# EAGLE design adcmp572-pulser (EAGLE 9.4.2)
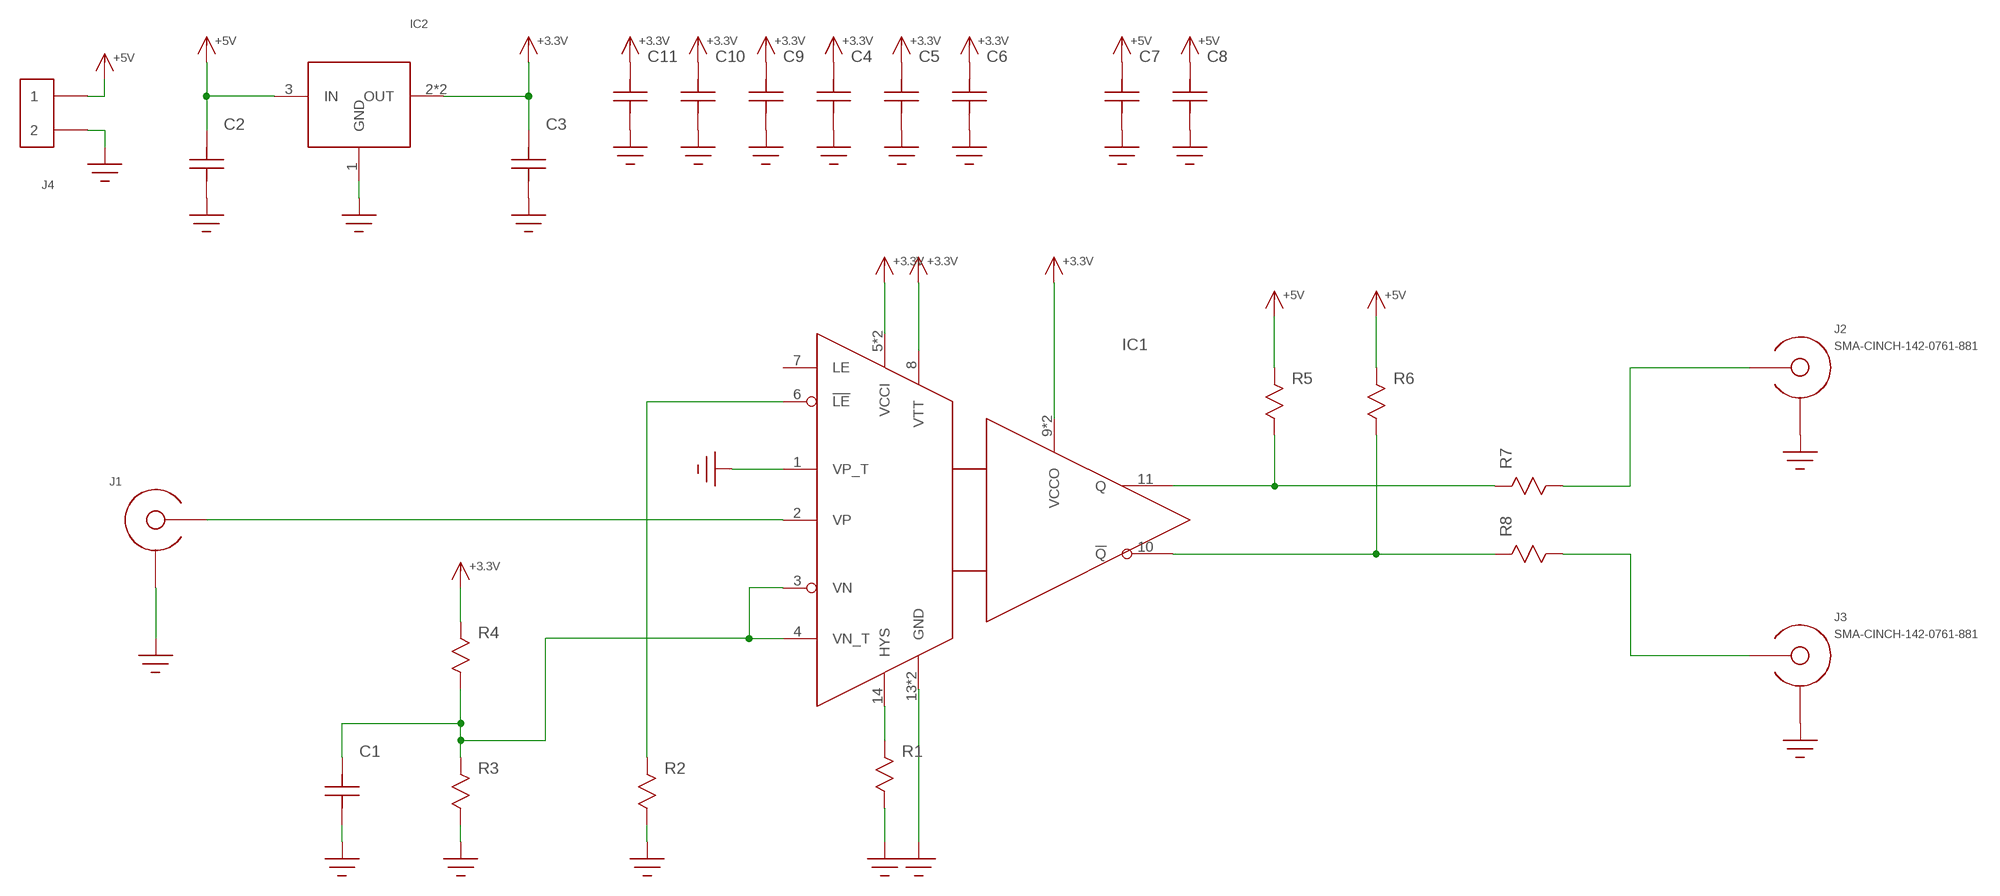
[diagram p0: schematic, sheet 1]

## Parts
C1  C0603  [C0603]
C2  C1206  [1206]
C3  C1206  [1206]
C4  C  [C0402]
C5  C  [C0402]
C6  C  [C0402]
C7  C  [C0402]
C8  C  [C0402]
C9  C  [C0402]
C10  C0201  [0201]
C11  C0201  [0201]
IC1  ADCMP572  [TQFN16-EP]
IC2  AZ1117E  [SOT-223]
J1  SMA-EDGE-LAUNCH4L-4020-TAPER-FIXED  [SMA_EDGE_LAUNCH_4L_4020_TAPER_FIXED]
J2  SMA-CINCH-142-0761-881  [SMA-CINCH-142-0761-881]
J3  SMA-CINCH-142-0761-881  [SMA-CINCH-142-0761-881]
J4  HEADER_2PIN  [HEADER_2PIN]
R1  R0603  [R0603]
R2  R0603  [R0603]
R3  R0603  [R0603]
R4  R0603  [R0603]
R5  R0402  [0402]
R6  R0402  [0402]
R7  R0402  [0402]
R8  R0402  [0402]

## Nets
+3.3V: C3.P$2 C4.2 C5.2 C6.2 C9.2 C10.P$2 C11.P$2 IC1.5(VCCI) IC1.8(VTT) IC1.9(VCCO) IC1.12(VCCO) IC1.16(VCCI) IC2.2(OUT) IC2.4(OUT) R4.P$1
+5V: C2.P$2 C7.2 C8.2 IC2.3(IN) J4.1 R5.1 R6.1
GND: C1.P$1 C2.P$1 C3.P$1 C4.1 C5.1 C6.1 C7.1 C8.1 C9.1 C10.P$1 C11.P$1 IC1.1(VP_T) IC1.13(GND) IC1.15(GND) IC2.1(GND) J1.BOTTOM_GND(SHIELD) J1.GND@1(SHIELD) J1.GND@2(SHIELD) J1.GND@3(SHIELD) J1.GND@4(SHIELD) J1.GND@5(SHIELD) J1.GND@6(SHIELD) J1.GND@7(SHIELD) J1.GND@8(SHIELD) J1.GND@14(SHIELD) J1.GND@15(SHIELD) J1.GND@16(SHIELD) J1.GND@17(SHIELD) J1.GND_PAD1(SHIELD) J1.GND_PAD2(SHIELD) J1.P$1(SHIELD) J1.P$2(SHIELD) J2.GND@1(SHIELD) J2.GND@2(SHIELD) J2.GND@3(SHIELD) J2.HOLE@1(SHIELD) J2.HOLE@2(SHIELD) J2.HOLE@3(SHIELD) J2.HOLE@4(SHIELD) J2.VIA@1(SHIELD) J2.VIA@2(SHIELD) J2.VIA@3(SHIELD) J2.VIA@4(SHIELD) J2.VIA@5(SHIELD) J2.VIA@6(SHIELD) J3.GND@1(SHIELD) J3.GND@2(SHIELD) J3.GND@3(SHIELD) J3.HOLE@1(SHIELD) J3.HOLE@2(SHIELD) J3.HOLE@3(SHIELD) J3.HOLE@4(SHIELD) J3.VIA@1(SHIELD) J3.VIA@2(SHIELD) J3.VIA@3(SHIELD) J3.VIA@4(SHIELD) J3.VIA@5(SHIELD) J3.VIA@6(SHIELD) J4.2 R1.P$2 R2.P$2 R3.P$2
N$1: IC1.14(HYS) R1.P$1
N$2: IC1.6(!LE!) R2.P$1
N$3 [12.5-6]: IC1.2(VP) J1.CENTER@1(CENTER) J1.P$3(CENTER)
N$4: C1.P$2 IC1.3(VN) IC1.4(VN_T) R3.P$1 R4.P$2
N$5 [12.5-6]: J2.CENTER R7.2
N$6 [12.5-6]: J3.CENTER R8.2
N$7: IC1.11(Q) R5.2 R7.1
N$8: IC1.10(!Q!) R6.2 R8.1
Unconnected: IC1.7(LE)

## Library data of the parts
C1-C11 = yapo:C
IC1 = yapo:ADCMP572
IC2 = yapo:AZ1117E
J1 = yapo:SMA-EDGE-LAUNCH
J2 J3 = yapo:SMA-CINCH-142-0761-881
J4 = yapo:HEADER_2PIN
R1-R8 = yapo:R

## Net classes
1 12.5-6: width 0.318 mm, clearance 0.152 mm

## Board
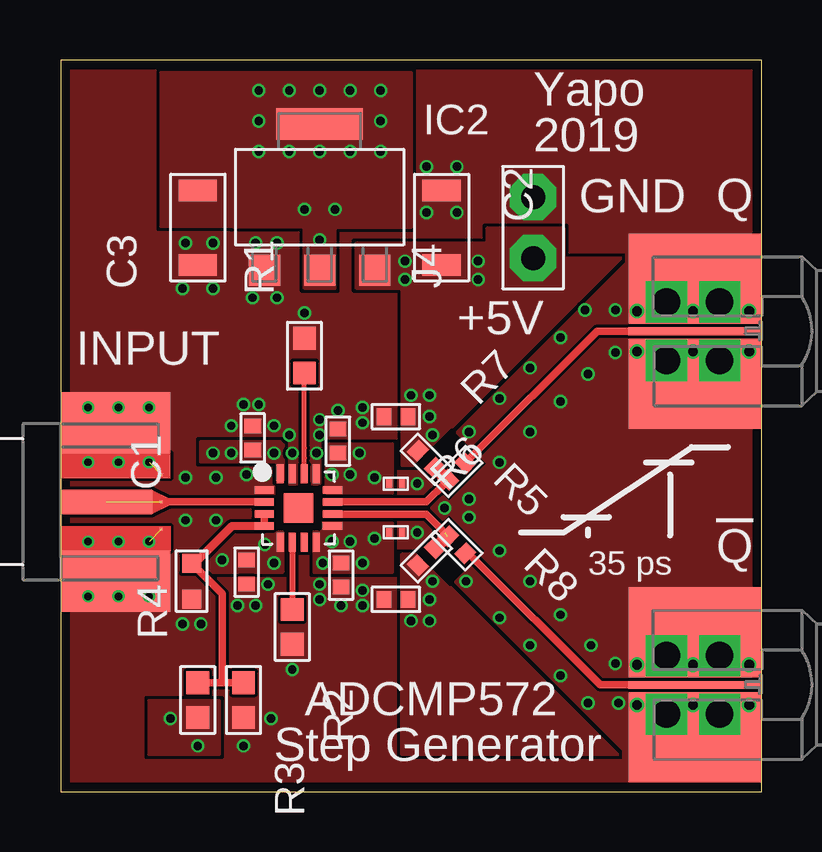
[diagram p1: board, top side]
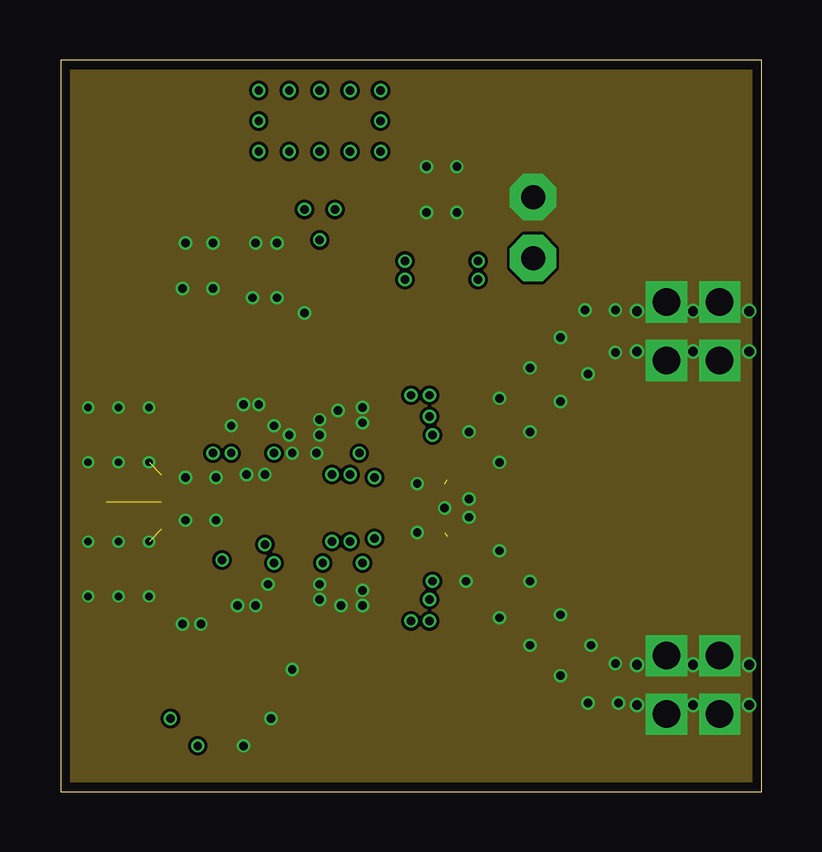
[diagram p2: board, inner layer Route2]
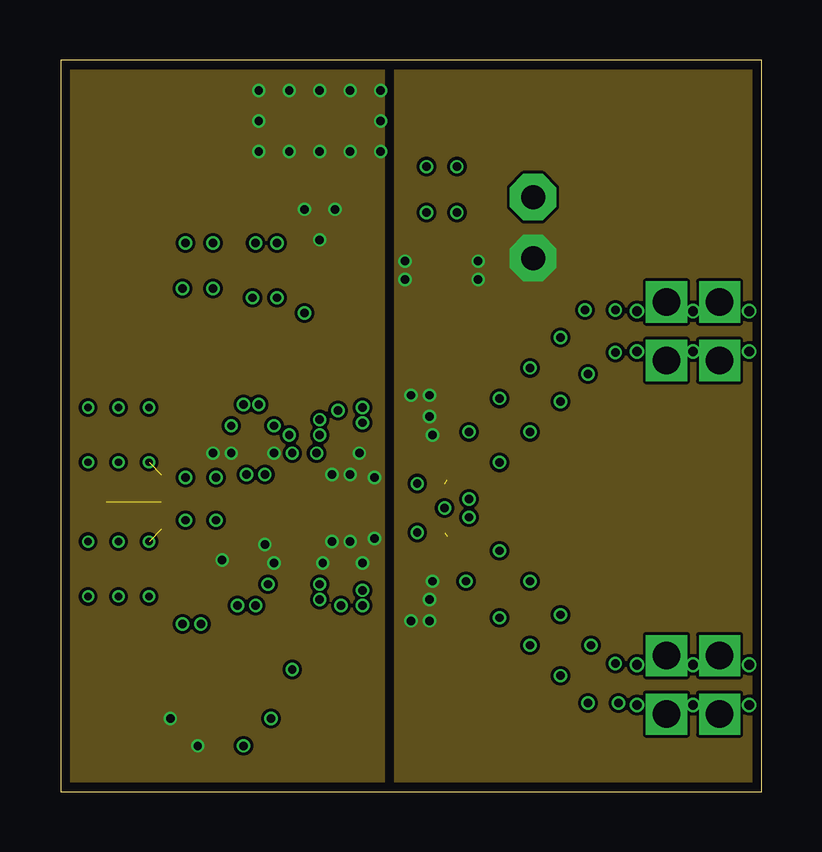
[diagram p3: board, inner layer Route15]
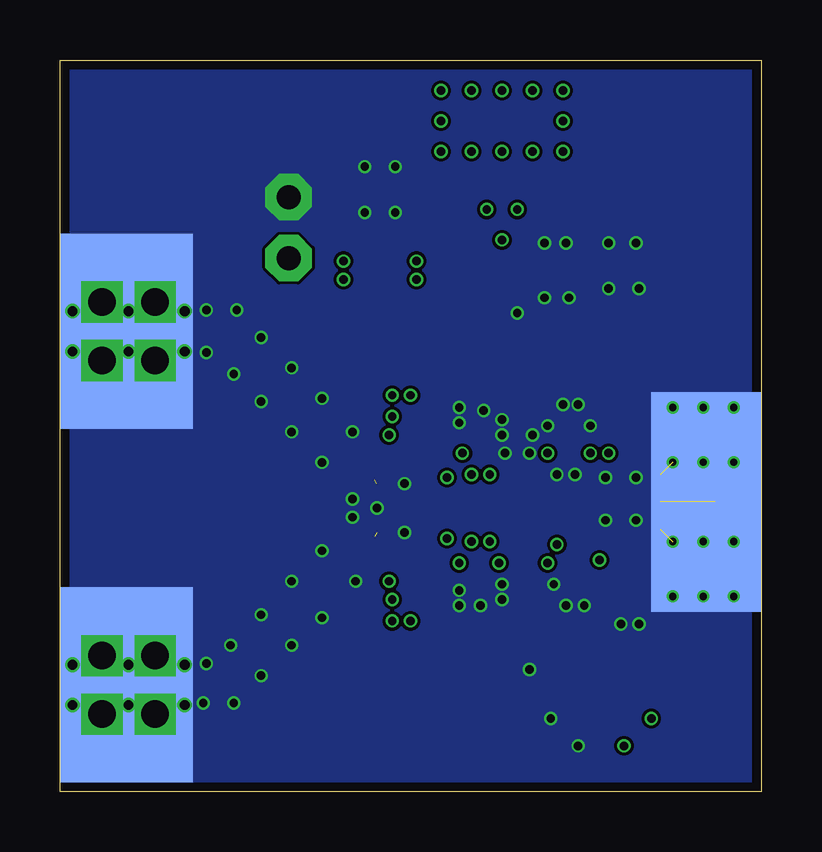
[diagram p4: board, bottom side, seen from below]

Size 29.21 x 30.48 mm. Coordinates in mm from the lower left corner, seen from the top.
Outline: 0,0 29.21,0 29.21,30.48 0,30.48 0,0
Copper layers (1*2*15*16): Top 0.035559375mm / dielectric 0.17018125mm / Route2 0.01778125mm / dielectric 47mil / Route15 0.01778125mm / dielectric 0.17018125mm / Bottom 0.035559375mm
Design rules "oshpark-4layer *": minimum track width 5mil, minimum drill 10mil, track to track 5mil, track to pad 5mil, pad to pad 5mil, via to via 5mil, smd to smd 5mil, copper to edge 15mil, drill to drill 6mil, minimum pad ring 4mil, minimum via ring 4mil, stop-mask expansion 2.5mil, vias tented up to drill 20mil, thermal gap 10mil
tRestrict: area 9,10.9 to 10.8,12.7

### Footprints (pad centres in the part's own frame; a part is rotated, then mirrored left to right if it is on the bottom)
C0603 = smd 0.8 x 0.8: P$1 -0.75,0; P$2 0.75,0
1206 = smd 0.9 x 1.6: P$1 -1.55,0; P$2 1.55,0
C0402 = smd 0.6 x 0.7: 1 -0.5,0; 2 0.5,0
0201 = smd 0.35 x 0.25: P$1 0,0.275; P$2 0,-0.275
TQFN16-EP = smd 0.3 x 0.8: 1 -0.75,-1.425; 2 -0.25,-1.425; 3 0.25,-1.425; 4 0.75,-1.425; 9 0.75,1.425; 10 0.25,1.425; 11 -0.25,1.425; 12 -0.75,1.425 | smd 0.8 x 0.3: 5 1.425,-0.75; 6 1.425,-0.25; 7 1.425,0.25; 8 1.425,0.75; 13 -1.425,0.75; 14 -1.425,0.25; 15 -1.425,-0.25; 16 -1.425,-0.75 | smd 1.23 x 1.23: EP 0,0
SOT-223 = smd 1.3 x 1.3: 1 -2.3,-3.05; 2 0,-3.05; 3 2.3,-3.05 | smd 3.6 x 1.3: 4 0,3.05
SMA_EDGE_LAUNCH_4L_4020_TAPER_FIXED = smd 4.572 x 9.144 bottom: BOTTOM_GND 2.286,0 | smd 3.81 x 1.016: CENTER@1 1.905,0 | drill 0.3: GND@1 1.143,3.937; GND@2 3.683,3.937; GND@3 1.143,1.651; GND@4 3.683,1.651; GND@5 1.143,-1.651; GND@6 3.683,-1.651; GND@7 1.143,-3.937; GND@8 3.683,-3.937; GND@14 2.413,3.937; GND@15 2.413,-3.937; GND@16 2.413,-1.651; GND@17 2.413,1.651 | smd 4.572 x 2.54: GND_PAD1 2.286,3.302; GND_PAD2 2.286,-3.302 | smd 0.127 x 0.127: P$1 4.191,1.143; P$2 4.191,-1.143; P$3 4.191,0
SMA-CINCH-142-0761-881 = smd 0.318 x 5.537: CENTER 0,-2.794 | smd 3.747 x 5.537: GND@1 -2.184,-2.769; GND@2 2.184,-2.769 | smd 8.128 x 5.537 bottom: GND@3 0,-2.769 | drill 1.143 pad 1.422 square: HOLE@1 -1.219,-3.962; HOLE@2 1.219,-3.962; HOLE@3 1.219,-1.753; HOLE@4 -1.219,-1.753 | drill 0.406 pad 0.61: VIA@1 -0.838,-5.194; VIA@2 0.838,-5.194; VIA@3 0.838,-2.857; VIA@4 0.838,-0.521; VIA@5 -0.838,-0.521; VIA@6 -0.838,-2.857
HEADER_2PIN = drill 1 pad 1.93 octagon: 1 -1.27,0; 2 1.27,0
R0603 = smd 0.95 x 0.95: P$1 -0.725,0; P$2 0.725,0
0402 = smd 0.6 x 0.7: 1 -0.5,0; 2 0.5,0

### Placement (x,y rotation side)
C1  5.46,8.76 90 top
C2  15.88,23.5 270 top
C3  5.71,23.5 90 top
C4  7.75,9.14 90 top
C5  11.68,9.02 90 top
C6  8,14.73 270 top
C7  13.97,8 0 top
C8  13.97,15.62 0 top
C9  11.56,14.61 270 top
C10  13.97,12.83 270 top
C11  13.97,10.79 270 top
IC1  9.91,11.81 270 top
IC2  10.79,24.77 0 top
J1  0,12.06 0 top
J2  29.21,19.18 270 top
J3  29.21,4.45 270 top
J4  19.68,23.5 90 top
R1  10.16,18.16 90 top
R2  9.65,6.86 270 top
R3  7.62,3.81 270 top
R4  5.71,3.81 90 top
R5  15.24,13.84 315 top
R6  15.24,9.78 45 top
R7  16.51,13.34 45 top
R8  16.51,10.29 315 top

### Tracks (layer width: path | path; a pad name or v marks a point on that pad's centre or on a via)
+3.3V  (via drill 0.35)
  other vias: 6.35,14.1 7.11,14.1 8.89,14.1 12.45,14.1 12.06,13.21 13.08,13.08 8.89,9.53 8.51,10.29 6.73,9.65 10.92,9.53 11.3,13.21 11.3,10.41 12.57,9.53 4.57,3.05 5.71,1.91 10.79,22.99 10.79,26.67 9.53,26.67 12.06,26.67 12.06,29.21 10.79,29.21 9.53,29.21 8.26,29.21 13.34,29.21 13.34,27.94 8.26,27.94 8.26,26.67 13.34,26.67 12.06,10.41 13.08,10.54 11.43,24.26 10.16,24.26
  pour Top (no thermals): 5.84,14.61 9.27,14.61 9.27,12.95 9.02,12.95 9.02,13.72 5.84,13.72
  pour Top (no thermals): 11.05,12.45 13.84,12.45 13.84,14.48 12.06,14.48 11.05,14.48
  pour Top (no thermals): 6.1,9.14 9.27,9.14 9.27,10.79 6.1,10.79
  pour Top (no thermals): 10.54,11.18 10.54,9.14 13.84,9.14 13.84,11.18
  pour Top (no thermals): 3.68,3.81 6.6,3.81 6.6,1.52 3.68,1.52
  pour Top (no thermals): 4.19,23.53 4.19,29.97 14.61,29.97 14.61,23.5 11.43,23.5 11.43,20.95 10.16,20.95 10.16,23.5
  pour Route15 (no thermals): 0,0 13.46,0 13.46,30.48 0,30.48
+5V  (via drill 0.35)
  other vias: 14.35,22.1 14.35,21.34 17.4,22.1 17.4,21.34 14.61,16.51 14.61,7.11 15.49,14.86 15.37,8 15.37,15.62 15.37,7.11 15.37,16.51 15.49,8.76
  pour Top (no thermals): 14.22,13.59 14.73,13.59 23.37,22.23 14.22,22.23
  pour Top (no thermals): 14.22,9.91 14.86,9.91 23.24,1.52 14.22,1.52
  pour Top (no thermals): 12.32,22.86 17.78,22.86 17.78,23.5 20.95,23.5 20.95,20.95 12.32,20.95
  pour Route15 (no thermals): 29.21,0 13.97,0 13.97,30.48 29.21,30.48
GND  (via drill 0.35)  (2 unrouted)
  other vias: 8.51,13.21 9.65,14.1 10.67,14.1 7.75,13.21 9.53,14.86 10.79,14.86 8.89,15.24 7.11,15.24 11.56,15.88 5.08,6.99 5.84,6.99 8.64,8.64 7.37,7.75 11.68,7.75 10.79,8.64 9.65,5.08 10.16,19.94 8.76,3.05 7.62,1.91 10.79,8 5.21,22.86 6.35,22.86 5.08,20.95 6.35,20.95 15.24,24.13 16.51,24.13 16.51,26.04 15.24,26.04 8,20.57 9.02,20.57 8.13,22.86 9.02,22.86 5.21,13.08 5.21,11.3 6.48,13.08 6.48,11.3 16,11.81 17.02,12.19 17.02,11.43 18.29,13.72 18.29,16.38 18.29,10.03 18.29,7.24 19.56,6.1 19.56,8.76 20.83,7.37 20.83,4.83 22.1,6.1 21.97,3.68 23.11,5.33 23.24,3.68 16.89,8.76 19.56,17.65 19.56,14.99 20.83,18.92 20.83,16.26 21.84,20.07 21.97,17.4 23.11,18.29 23.11,20.07 17.02,14.99 10.79,15.49 7.62,16.13 8.26,16.13 8.13,7.75 14.86,12.83 14.86,10.79 12.57,16 12.57,15.37 12.57,8.38 12.57,7.75
  pour Top (rank 2, no thermals): 0,0 29.21,0 29.21,30.48 0,30.48
  pour Route2 (no thermals): 0,0 29.21,0 29.21,30.48 0,30.48
  pour Bottom (no thermals): 0,0 29.21,0 29.21,30.48 0,30.48
  cutout Top: 14.73,13.59 16.26,15.11 17.72,13.65 16.19,12.13
  cutout Top: 14.73,10.03 16.19,11.49 17.65,10.03 16.19,8.57
N$1
  Top 0.203: R1.P$1 10.16,14.31 10.16,13.89 IC1.14
N$2
  Top 0.254: IC1.6 R2.P$1
  Top 0.305: R2.P$1
N$3  (1 unrouted)
  Top 0.318: J1.CENTER@1 IC1.2
N$4
  Top 0.305: IC1.3 IC1.4 | 6.73,4.54 R4.P$2 | R3.P$1 6.73,4.54 | 6.73,4.54 6.73,8.24 C1.P$2
  Top 0.343: IC1.4 7.14,11.06 5.59,9.51 C1.P$2
N$5
  Top 0.318: J2.CENTER 22.35,19.18 R7.2
N$6
  Top 0.318: J3.CENTER 22.48,4.45 16.99,9.93 R8.2
N$7  (1 unrouted)
  Top 0.318: IC1.11 15.24,12.06 16,12.83
  Top 0.508: R7.1 16.1,12.98 R5.2
N$8  (1 unrouted)
  Top 0.318: IC1.10 15.24,11.56 16.01,10.79
  Top 0.508: R6.2 16.1,10.64 R8.1

### Text on the board
tPlace: Yapo | 2019 | GND | Q | +5V | INPUT | !Q! | 35 ps | ADCMP572 | Step Generator